# Altium project X-Sub_Board.PrjPcb
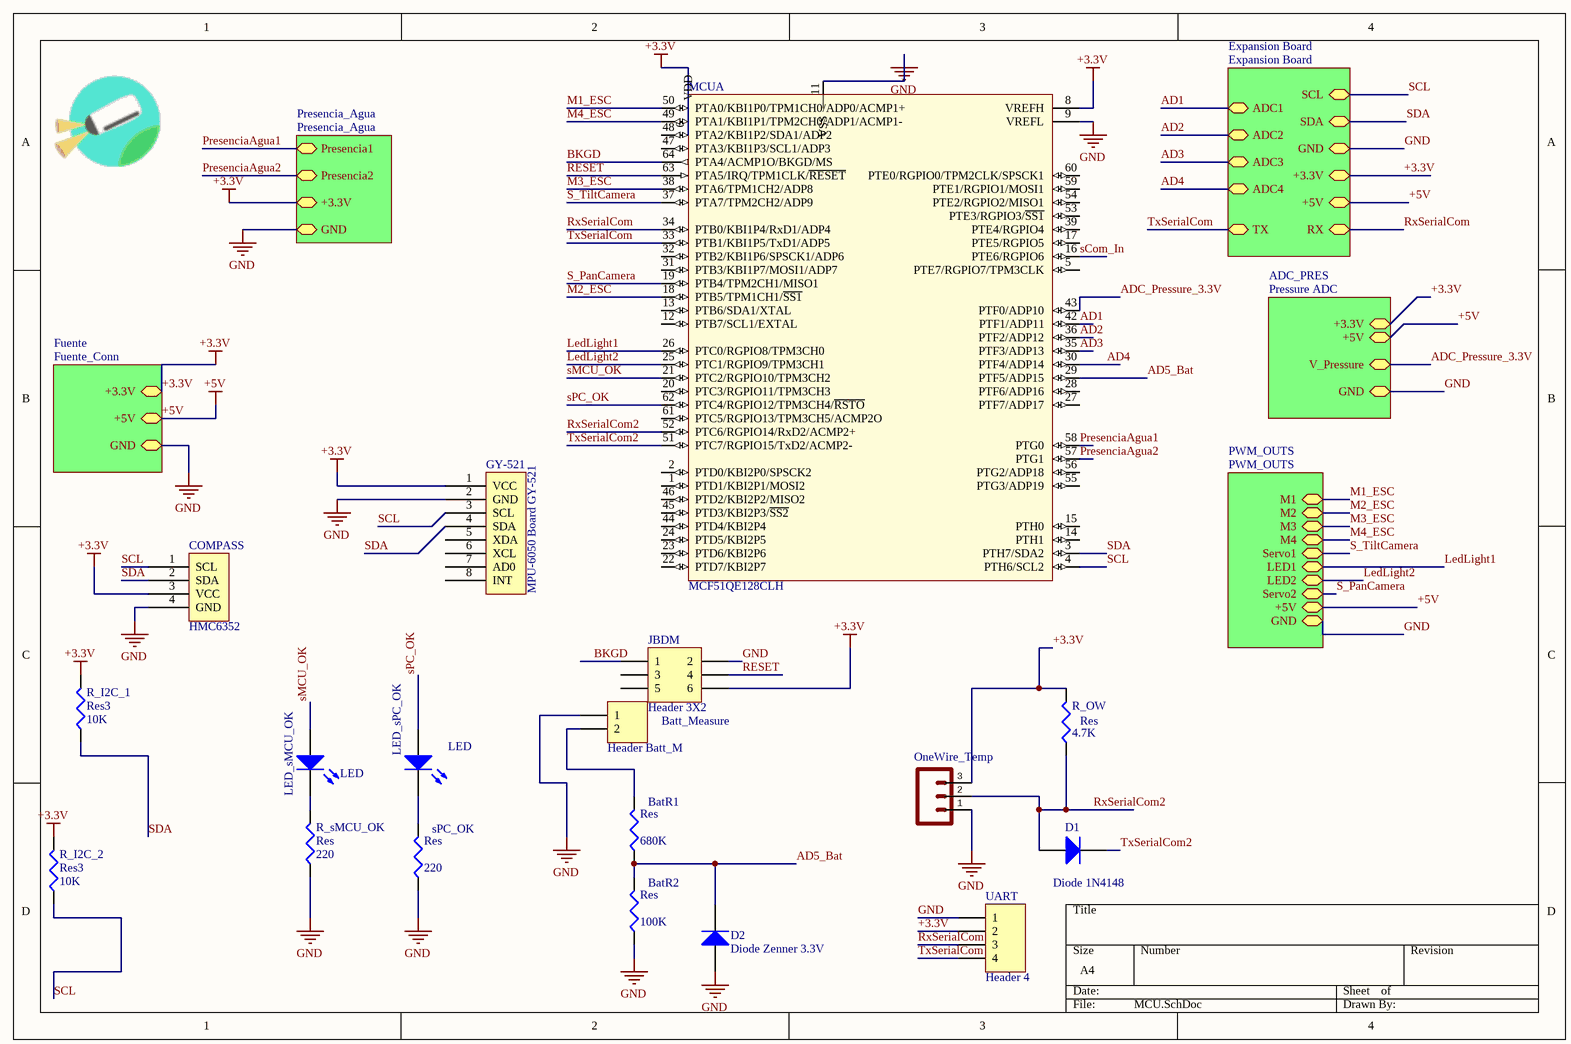
[diagram p0: MCU.SchDoc]
6 sheets, 40 parts. Net scope: hierarchical (ports join the sheet entries above them; power ports are global).
Board files: MCU.PcbDoc, LOGOS.PcbDoc
Sheets:
  MCU.SchDoc
    Fuente = Fuente_Conn.SchDoc
    Expansion Board = Expansion Board.SchDoc
    ADC_PRES = Pressure ADC.SchDoc
    PWM_OUTS = PWM_OUTS.SchDoc
    Presencia_Agua = Presencia_Agua.SchDoc

## Sheet MCU.SchDoc
size A4; PageSetup: Record=PageOptions|CenterHorizontal=True|CenterVertical=True|PrintScale=0.98|XCorrection=1.00|YCorrection=1.00|PrintKind=1|BorderSize=5000000|LeftOffset=0|BottomOffset=0|Orientation=2|PaperLength=1000|PaperWidth=1000|Scale=100|PaperSource=7|PrintQuality=-3|MediaType=1|DitherType=10|PrintScaleMode=1|PaperKind=Carta|PaperIndex=1

### Parts
BatR1  Res  value 680K  [6-0805_L]
BatR2  Res  value 100K  [6-0805_L]
Batt_Measure  Header Batt_M  [5.08mm 200 mil Screw Terminal SF]
COMPASS  HMC6352  [HMC6352_SF]
D1  Diode 1N4148  [miniMELF]
D2  Diode Zenner 3.3V  [miniMELF]
GY-521  MPU-6050 Board GY-521  [GY-521]
JBDM  Header 3X2  [HDR2X3]
LED_sMCU_OK  LED  [6-0805_L]
LED_sPC_OK  LED  [6-0805_L]
MCU  MCF51QE128CLH  [840F-02_N]  (part A of 2)
OneWire_Temp  (no value)  [HDR1X3]
R_I2C_1  Res3  value 10K  [6-0805_L]
R_I2C_2  Res3  value 10K  [6-0805_L]
R_OW  Res  value 4.7K  [6-0805_L]
R_sMCU_OK  Res  value 220  [6-0805_L]
sPC_OK  Res  value 220  [6-0805_L]
UART  Header 4  [HDR1X4]

### Sub-sheets
ADC_PRES = Pressure ADC: +3.3V, GND, V_Pressure (bidir), +5V
Expansion Board = Expansion Board: SCL, SDA, GND, +3.3V, +5V, ADC4 (bidir), ADC1 (bidir), ADC2 (bidir), ADC3 (bidir), RX, TX
Fuente = Fuente_Conn: +3.3V, +5V, GND
Presencia_Agua = Presencia_Agua: GND, +3.3V, Presencia2, Presencia1
PWM_OUTS = PWM_OUTS: M1, M2, M3, M4, LED1, LED2, +5V, GND, Servo1, Servo2

### Nets
+3.3V: COMPASS.3(VCC) GY-521.1(VCC) JBDM.6 MCU.6(VDD) MCU.8(VREFH) OneWire_Temp.3 R_I2C_1.2 R_I2C_2.2 R_OW.2 UART.2 ; sheet Fuente/+3.3V, sheet Expansion Board/+3.3V, sheet ADC_PRES/+3.3V, sheet Presencia_Agua/+3.3V
+5V: sheet Fuente/+5V, sheet Expansion Board/+5V, sheet ADC_PRES/+5V, sheet PWM_OUTS/+5V
GND: BatR2.1 Batt_Measure.1 COMPASS.4(GND) D2.1(A) GY-521.2(GND) JBDM.2 MCU.9(VREFL) MCU.11(VSS) OneWire_Temp.1 R_sMCU_OK.1 sPC_OK.1 UART.1 ; sheet Fuente/GND, sheet Expansion Board/GND, sheet ADC_PRES/GND, sheet PWM_OUTS/GND, sheet Presencia_Agua/GND
AD1: MCU.42(PTF1/ADP11) ; sheet Expansion Board/ADC1
AD2: MCU.36(PTF2/ADP12) ; sheet Expansion Board/ADC2
AD3: MCU.35(PTF3/ADP13) ; sheet Expansion Board/ADC3
AD4: MCU.30(PTF4/ADP14) ; sheet Expansion Board/ADC4
AD5_Bat: BatR1.1 BatR2.2 D2.2(K) MCU.29(PTF5/ADP15)
ADC_Pressure_3.3V: MCU.43(PTF0/ADP10) ; sheet ADC_PRES/V_Pressure
BKGD: JBDM.1 MCU.64(PTA4/ACMP1O/BKGD/MS)
LedLight1: MCU.26(PTC0/RGPIO8/TPM3CH0) ; sheet PWM_OUTS/LED1
LedLight2: MCU.25(PTC1/RGPIO9/TPM3CH1) ; sheet PWM_OUTS/LED2
M1_ESC: MCU.50(PTA0/KBI1P0/TPM1CH0/ADP0/ACMP1+) ; sheet PWM_OUTS/M1
M2_ESC: MCU.18(PTB5/TPM1CH1/~{SS1}) ; sheet PWM_OUTS/M2
M3_ESC: MCU.38(PTA6/TPM1CH2/ADP8) ; sheet PWM_OUTS/M3
M4_ESC: MCU.49(PTA1/KBI1P1/TPM2CH0/ADP1/ACMP1-) ; sheet PWM_OUTS/M4
PresenciaAgua1: MCU.58(PTG0) ; sheet Presencia_Agua/Presencia1
PresenciaAgua2: MCU.57(PTG1) ; sheet Presencia_Agua/Presencia2
RESET: JBDM.4 MCU.63(PTA5/IRQ/TPM1CLK/~{RESET})
RxSerialCom: MCU.34(PTB0/KBI1P4/RxD1/ADP4) UART.3 ; sheet Expansion Board/RX
RxSerialCom2: D1.1(A) MCU.52(PTC6/RGPIO14/RxD2/ACMP2+) OneWire_Temp.2 R_OW.1
S_PanCamera: MCU.19(PTB4/TPM2CH1/MISO1) ; sheet PWM_OUTS/Servo2
S_TiltCamera: MCU.37(PTA7/TPM2CH2/ADP9) ; sheet PWM_OUTS/Servo1
SCL: COMPASS.1(SCL) GY-521.3(SCL) MCU.4(PTH6/SCL2) R_I2C_2.1 ; sheet Expansion Board/SCL
sCom_In: MCU.16(PTE6/RGPIO6)
SDA: COMPASS.2(SDA) GY-521.4(SDA) MCU.3(PTH7/SDA2) R_I2C_1.1 ; sheet Expansion Board/SDA
sMCU_OK: LED_sMCU_OK.1(A) MCU.21(PTC2/RGPIO10/TPM3CH2)
sPC_OK: LED_sPC_OK.1(A) MCU.62(PTC4/RGPIO12/TPM3CH4/~{RSTO})
TxSerialCom: MCU.33(PTB1/KBI1P5/TxD1/ADP5) UART.4 ; sheet Expansion Board/TX
TxSerialCom2: D1.2(K) MCU.51(PTC7/RGPIO15/TxD2/ACMP2-)
NetBatR1_2: BatR1.2 Batt_Measure.2
NetLED_sMCU_OK_2: LED_sMCU_OK.2(K) R_sMCU_OK.2
NetLED_sPC_OK_2: LED_sPC_OK.2(K) sPC_OK.2

Not connected (* = marked no-connect by the designer): GY-521 5(XDA) 6(XCL) 7(AD0) 8(INT); JBDM 3 5; MCU 1(PTD1/KBI2P1/MOSI2) 2(PTD0/KBI2P0/SPSCK2) 5(PTE7/RGPIO7/TPM3CLK) 12(PTB7/SCL1/EXTAL) 13(PTB6/SDA1/XTAL) 14(PTH1) 15(PTH0) 17(PTE5/RGPIO5) 20(PTC3/RGPIO11/TPM3CH3) 22(PTD7/KBI2P7) 23(PTD6/KBI2P6) 24(PTD5/KBI2P5) 27(PTF7/ADP17) 28(PTF6/ADP16) 31(PTB3/KBI1P7/MOSI1/ADP7) 32(PTB2/KBI1P6/SPSCK1/ADP6) 39(PTE4/RGPIO4) 44(PTD4/KBI2P4) 45(PTD3/KBI2P3/~{SS2}) 46(PTD2/KBI2P2/MISO2) 47(PTA3/KBI1P3/SCL1/ADP3) 48(PTA2/KBI1P2/SDA1/ADP2) 53(PTE3/RGPIO3/~{SS1}) 54(PTE2/RGPIO2/MISO1) 55(PTG3/ADP19) 56(PTG2/ADP18) 59(PTE1/RGPIO1/MOSI1) 60(PTE0/RGPIO0/TPM2CLK/SPSCK1) 61(PTC5/RGPIO13/TPM3CH5/ACMP2O)

### Library data of the parts
BatR1 BatR2 R_I2C_1 R_I2C_2 R_OW R_sMCU_OK sPC_OK = Res3: Resistor; Published: 8-Jun-2000; LatestRevisionDate: 29-May-2009; LatestRevisionNote: IPC-7351 Footprint Added.; PackageReference: J1-0603; Publisher: Altium Limited; PackageDescription: Chip Resistor
Batt_Measure = Header 2: Header, 2-Pin; LatestRevisionDate: 17-Jul-2002; LatestRevisionNote: Re-released for DXP Platform.; Publisher: Altium Limited
D1 D2 = Diode 1N4148: High Conductance Fast Diode; Published: 8-Jun-2000; LatestRevisionDate: 17-Jul-2002; LatestRevisionNote: Re-released for DXP Platform.; DatasheetVersion: 1997; PackageReference: DO-35; Publisher: Altium Limited; PackageDescription: Diode, Axial; Body 3.8 x 1.9 mm (LxDia. max), Lead Dia. 0.53 mm (max); Code_JEDEC: DO-204-AH; ComponentLink1Description: Manufacturer Link; ComponentLink1URL: http://www.fairchildsemi.com/; ComponentLink2Description: Datasheet; ComponentLink2URL: http://www.fairchildsemi.com/ds/1N%2F1N4148.pdf
GY-521 = GY-521
JBDM = Header 3X2: Header, 3-Pin, Dual row; LatestRevisionDate: 17-Jul-2002; LatestRevisionNote: Re-released for DXP Platform.; Publisher: Altium Limited
LED_sMCU_OK LED_sPC_OK = LED2: Typical RED, GREEN, YELLOW, AMBER GaAs LED; Published: 8-Jun-2000; LatestRevisionDate: 17-Jul-2002; LatestRevisionNote: Re-released for DXP Platform.; PackageVersion: Feb-2002; PackageReference: 3.2X1.6X1.1; Publisher: Altium Limited; PackageDescription: SM LED; 2 Flat Leads
MCU = MCF51QE128CLH: MCF51QE128 ColdFire V1 Microcontroller, 32-Bit, 128KB Flash, 8KB RAM, -40°C to 85°C, 64-Pin LQFP; DatasheetVersion: rev7, Oct-2008; PackageVersion: rev6, Mar-2011; PackageReference: 840F-02; PackageDescription: 64-Pin Thin Quad Flat Pack, 10 x 10 mm Body, 0.5 mm Pitch; ComponentLink1Description: Manufacturer URL; ComponentLink1URL: http://www.freescale.com/; ComponentLink2Description: Datasheet; ComponentLink2URL: http://cache.freescale.com/files/32bit/doc/data_sheet/MCF51QE128.pdf?fpsp=1&WT_TYPE=Data%20Sheets&WT_VENDOR=FREESCALE&WT_FILE_FORMAT=pdf&WT_ASSET=Documentation
OneWire_Temp = M03-SCREW-5MM: STOREFRONT_ID: PRT-08433
UART = Header 4: Header, 4-Pin; LatestRevisionDate: 17-Jul-2002; LatestRevisionNote: Re-released for DXP Platform.; Publisher: Altium Limited

## Sheet Fuente_Conn.SchDoc
size Letter
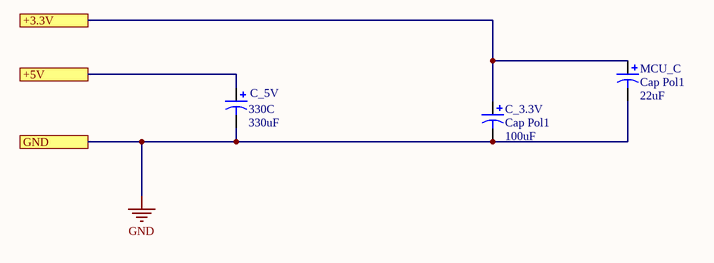
[diagram p1: Fuente_Conn.SchDoc]

### Parts
C_3.3V  Cap Pol1  value 100uF  [CAPR5-4X5]
C_5V  330C  value 330uF  [PANASONIC_C]
MCU_C  Cap Pol1  value 22uF  [CAPR5-4X5]

### Ports
+3.3V, +5V, GND

### Nets
+3.3V: C_3.3V.1 MCU_C.1 ; port +3.3V
+5V: C_5V.1 ; port +5V
GND: C_3.3V.2 C_5V.2 MCU_C.2 ; port GND

### Library data of the parts
C_3.3V C_5V MCU_C = Cap Pol1: Polarized Capacitor (Radial); Published: 8-Jun-2000; LatestRevisionDate: 17-Jul-2002; LatestRevisionNote: Re-released for DXP Platform.; PackageReference: RB7.6-15; Publisher: Altium Limited; PackageDescription: Polarized Capacitor (Radial); 2 Leads

## Sheet Expansion Board.SchDoc
size Letter
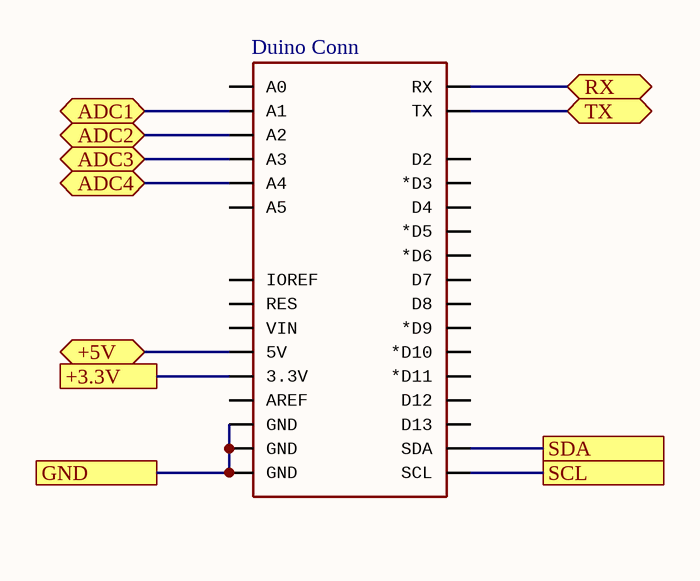
[diagram p2: Expansion Board.SchDoc]

### Parts
Duino_Conn  (no value)  [UNO_R3_SHIELD_NOLABELS]

### Ports
+3.3V, +5V, ADC1, ADC2, ADC3, ADC4, GND, RX, SCL, SDA, TX

### Nets
+3.3V: Duino_Conn.3.3V ; port +3.3V
+5V: Duino_Conn.5V ; port +5V
GND: Duino_Conn.GND@0(GND) Duino_Conn.GND@1(GND) Duino_Conn.GND@2(GND) ; port GND
AD1: Duino_Conn.A1 ; port ADC1
AD2: Duino_Conn.A2 ; port ADC2
AD3: Duino_Conn.A3 ; port ADC3
AD4: Duino_Conn.A4 ; port ADC4
RxSerialCom: Duino_Conn.RX ; port RX
SCL: Duino_Conn.SCL ; port SCL
SDA: Duino_Conn.SDA ; port SDA
TxSerialCom: Duino_Conn.TX ; port TX

Not connected (* = marked no-connect by the designer): Duino_Conn A0 A5 AREF D2 D3(*D3) D4 D5(*D5) D6(*D6) D7 D8 D9(*D9) D10(*D10) D11(*D11) D12 D13 IOREF RES VIN

### Library data of the parts
Duino_Conn = ARDUINO_R3_SHIELDNOLABELS

## Sheet Pressure ADC.SchDoc
size Letter
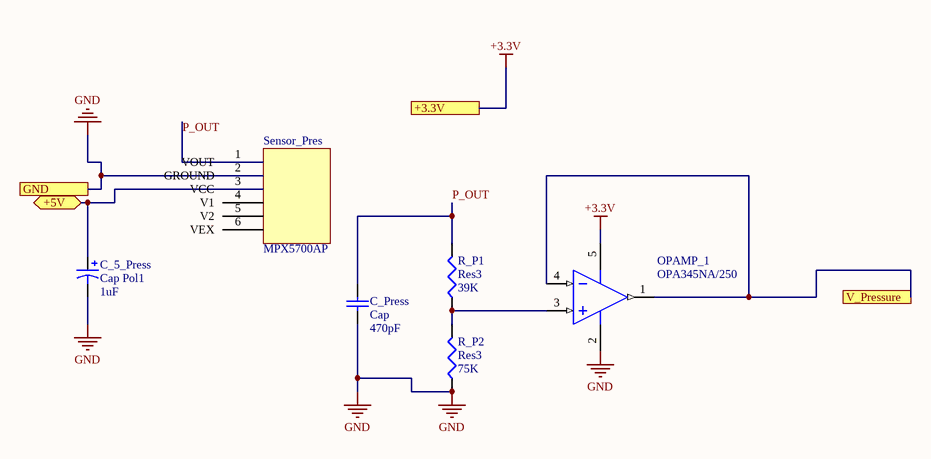
[diagram p3: Pressure ADC.SchDoc]

### Parts
C_5_Press  Cap Pol1  value 1uF  [CAPR5-4X5]
C_Press  Cap  value 470pF  [J1-0603]
OPAMP_1  OPA345NA/250  [TI-DBV5_N]
R_P1  Res3  value 39K  [J1-0603]
R_P2  Res3  value 75K  [J1-0603]
Sensor_Pres  MPX5700AP  [HDR1X6H]

### Ports
+3.3V, +5V, GND, V_Pressure

### Nets
+3.3V: OPAMP_1.5(V+) ; port +3.3V
+5V: C_5_Press.1 Sensor_Pres.3(VCC) ; port +5V
GND: C_5_Press.2 C_Press.1 OPAMP_1.2(V-) R_P2.1 Sensor_Pres.2(GROUND) ; port GND
ADC_Pressure_3.3V: OPAMP_1.1(OUT) OPAMP_1.4(IN-) ; port V_Pressure
P_OUT: C_Press.2 R_P1.2 Sensor_Pres.1(VOUT)
NetOPAMP_1_3: OPAMP_1.3(IN+) R_P1.1 R_P2.2

Not connected (* = marked no-connect by the designer): Sensor_Pres 4(V1) 5(V2) 6(VEX)

### Library data of the parts
C_5_Press = Cap Pol1: Polarized Capacitor (Radial); Published: 8-Jun-2000; LatestRevisionDate: 17-Jul-2002; LatestRevisionNote: Re-released for DXP Platform.; PackageReference: RB7.6-15; Publisher: Altium Limited; PackageDescription: Polarized Capacitor (Radial); 2 Leads
C_Press = Cap: Capacitor; Published: 8-Jun-2000; LatestRevisionDate: 17-Jul-2002; LatestRevisionNote: Re-released for DXP Platform.; PackageReference: RAD-0.3; Publisher: Altium Limited; PackageDescription: Radial Cap, Thru-Hole; 2 Leads; 0.3 in Pin Spacing
OPAMP_1 = OPA345NA/250: Low Power, Single-Supply, Rail-to-Rail Operational Amplifier MicroAmplifier(TM) Series, 2.7 to 5.5 V, -55 to 125 degC, 5-pin SOT23 (DBV5), Green (RoHS & no Sb/Br); Manufacturer: Texas Instruments; CMRR(Min)(dB): 76; IIB(Max)(pA): 10; Iq per channel(Max)(mA): 0.25; Number of Channels: 1; Offset Drift(Typ)(uV/C): 3; Slew Rate(Typ)(V/us): 2; Sub Family: Low Input Bias Current Amp (<=10pA), Low Power Amp (<=500uA), Low Supply Voltage Amplifier (<=2.7V), Precision Amplifier; Total Supply Voltage(Max)(+5V is 5, +/-5V is 10): 5.5; Total Supply Voltage(Min)(+5V is 5, +/-5V is 10): 2.7; DatasheetVersion: SBOS107A; PackageVersion: 4073253-4/K, 03/2006; PackageReference: DBV5; PackageDescription: 5-Pin Plastic Small Outline, Body 1.6 x 2.9 mm, Pitch 0.95 mm; Supplier 1: Digi-Key; Supplier Part Number 1: OPA345NATR-ND; Supplier 2: Digi-Key; Supplier Part Number 2: OPA345NACT-ND; Supplier 3: Digi-Key; Supplier Part Number 3: OPA345NADKR-ND; Supplier 4: Farnell; Supplier Part Number 4: 1648703; Supplier 5: Newark; Supplier Part Number 5: 75C4876; Supplier 6: Mouser; Supplier Part Number 6: 595-OPA345NA/250; Eco-Plan: Green (RoHS & no Sb/Br); Vio (25C)(Max)(mV): 1; Mounting Technology: Surface Mount; Code_JEDEC: MO-178; PartNumber: OPA345NA/250; ComponentLink1Description: Manufacturer URL; ComponentLink1URL: http://www.ti.com/; ComponentLink2Description: Datasheet; ComponentLink2URL: http://www.ti.com/general/docs/lit/getliterature.tsp?genericPartNumber=OPA345&fileType=pdf; ComponentLink3Description: Package Specification; ComponentLink3URL: http://www.ti.com/litv/pdf/mpds018i
R_P1 R_P2 = Res3: Resistor; Published: 8-Jun-2000; LatestRevisionDate: 29-May-2009; LatestRevisionNote: IPC-7351 Footprint Added.; PackageReference: J1-0603; Publisher: Altium Limited; PackageDescription: Chip Resistor

## Sheet PWM_OUTS.SchDoc
size Letter
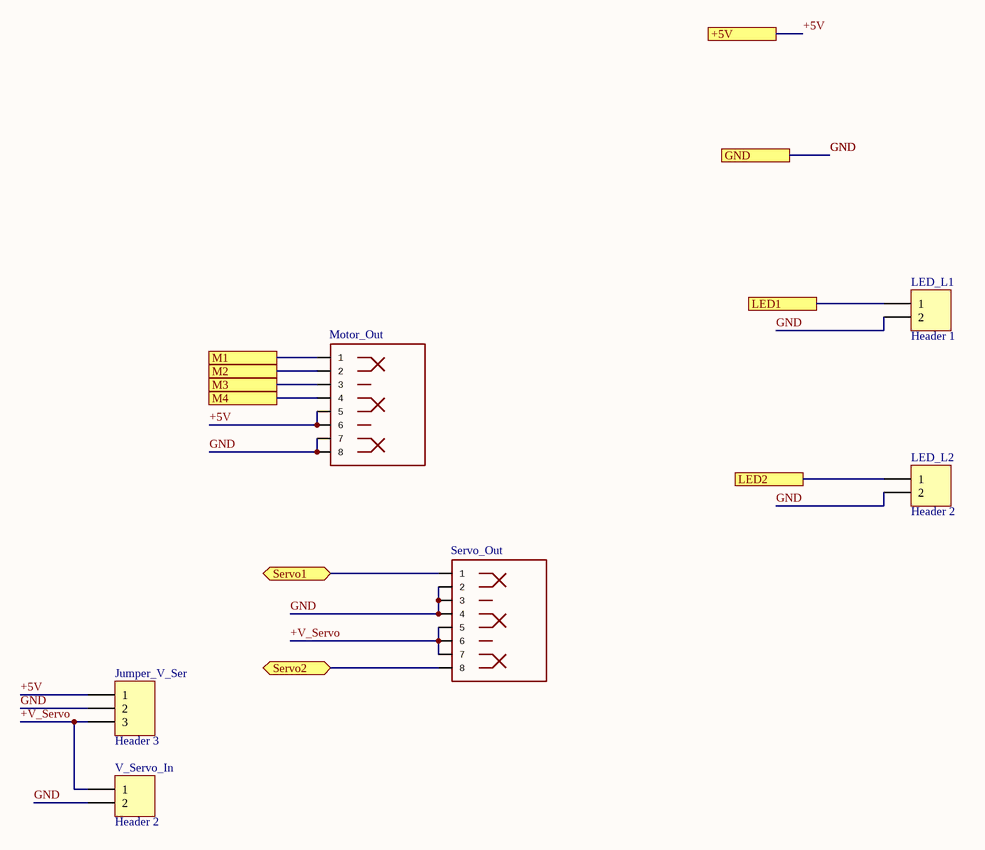
[diagram p4: PWM_OUTS.SchDoc]

### Parts
Jumper_V_Ser  Header 3  [HDR1X3]
LED_L1  Header 1  [HDR1X2]
LED_L2  Header 2  [HDR1X2]
Motor_Out  (no value)  [RJ45-8]
Servo_Out  (no value)  [RJ45-8]
V_Servo_In  Header 2  [HDR1X2]

### Ports
+5V, GND, LED1, LED2, M1, M2, M3, M4, Servo1, Servo2

### Nets
+5V: Jumper_V_Ser.1 Motor_Out.5 Motor_Out.6 ; port +5V
GND: Jumper_V_Ser.2 LED_L1.2 LED_L2.2 Motor_Out.7 Motor_Out.8 Servo_Out.2 Servo_Out.3 Servo_Out.4 V_Servo_In.2 ; port GND
+V_Servo: Jumper_V_Ser.3 Servo_Out.5 Servo_Out.6 Servo_Out.7 V_Servo_In.1
LedLight1: LED_L1.1 ; port LED1
LedLight2: LED_L2.1 ; port LED2
M1_ESC: Motor_Out.1 ; port M1
M2_ESC: Motor_Out.2 ; port M2
M3_ESC: Motor_Out.3 ; port M3
M4_ESC: Motor_Out.4 ; port M4
S_PanCamera: Servo_Out.8 ; port Servo2
S_TiltCamera: Servo_Out.1 ; port Servo1

### Library data of the parts
Jumper_V_Ser = Header 3: Header, 3-Pin; LatestRevisionDate: 17-Jul-2002; LatestRevisionNote: Re-released for DXP Platform.; Publisher: Altium Limited
LED_L1 LED_L2 V_Servo_In = Header 2: Header, 2-Pin; LatestRevisionDate: 17-Jul-2002; LatestRevisionNote: Re-released for DXP Platform.; Publisher: Altium Limited
Motor_Out Servo_Out = RJ45-8PTH: PROD_ID: CONN-08506

## Sheet Presencia_Agua.SchDoc
size Letter
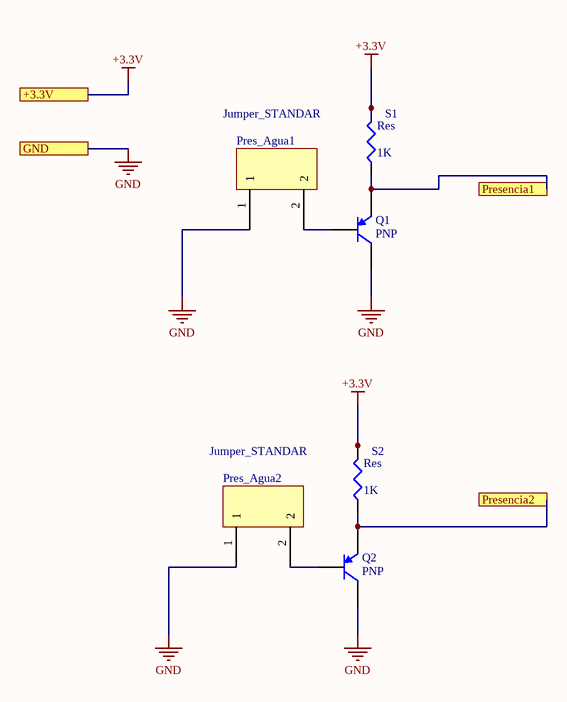
[diagram p5: Presencia_Agua.SchDoc]

### Parts
Pres_Agua1  Jumper_STANDAR  [HDR1X2H]
Pres_Agua2  Jumper_STANDAR  [HDR1X2H]
Q1  PNP  [SOT-23B_L]
Q2  PNP  [SOT-23B_L]
S1  Res  value 1K  [RESC6332]
S2  Res  value 1K  [RESC6332]

### Ports
+3.3V, GND, Presencia1, Presencia2

### Nets
+3.3V: S1.2 S2.2 ; port +3.3V
GND: Pres_Agua1.1 Pres_Agua2.1 Q1.1(C) Q2.1(C) ; port GND
PresenciaAgua1: Q1.3(E) S1.1 ; port Presencia1
PresenciaAgua2: Q2.3(E) S2.1 ; port Presencia2
NetPres_Agua1_2: Pres_Agua1.2 Q1.2(B)
NetPres_Agua2_2: Pres_Agua2.2 Q2.2(B)

### Library data of the parts
Q1 Q2 = PNP: PNP Bipolar Transistor; Published: 8-Jun-2000; LatestRevisionDate: 29-May-2009; LatestRevisionNote: IPC-7351 Footprint Added.; PackageVersion: Aug-1999; PackageReference: SOT-23B; Publisher: Altium Limited; PackageDescription: 3-Pin SOT-23 Package 0.95 mm Pitch, 2.4 mm Lead Span
S1 S2 = Res3: Resistor; Published: 8-Jun-2000; LatestRevisionDate: 29-May-2009; LatestRevisionNote: IPC-7351 Footprint Added.; PackageReference: J1-0603; Publisher: Altium Limited; PackageDescription: Chip Resistor

## Nets that join several sheets
+3.3V: MCU (10 pins), Fuente_Conn (C_3.3V.1 MCU_C.1), Expansion Board (Duino_Conn.3.3V), Pressure ADC (OPAMP_1.5), Presencia_Agua (S1.2 S2.2)
+5V: Fuente_Conn (C_5V.1), Expansion Board (Duino_Conn.5V), Pressure ADC (C_5_Press.1 Sensor_Pres.3), PWM_OUTS (Jumper_V_Ser.1 Motor_Out.5 Motor_Out.6)
GND: MCU (12 pins), Fuente_Conn (C_3.3V.2 C_5V.2 MCU_C.2), Expansion Board (Duino_Conn.GND@0 Duino_Conn.GND@1 Duino_Conn.GND@2), Pressure ADC (5 pins), PWM_OUTS (9 pins), Presencia_Agua (Pres_Agua1.1 Pres_Agua2.1 Q1.1 Q2.1)
AD1: MCU (MCU.42), Expansion Board (Duino_Conn.A1)
AD2: MCU (MCU.36), Expansion Board (Duino_Conn.A2)
AD3: MCU (MCU.35), Expansion Board (Duino_Conn.A3)
AD4: MCU (MCU.30), Expansion Board (Duino_Conn.A4)
ADC_Pressure_3.3V: MCU (MCU.43), Pressure ADC (OPAMP_1.1 OPAMP_1.4)
LedLight1: MCU (MCU.26), PWM_OUTS (LED_L1.1)
LedLight2: MCU (MCU.25), PWM_OUTS (LED_L2.1)
M1_ESC: MCU (MCU.50), PWM_OUTS (Motor_Out.1)
M2_ESC: MCU (MCU.18), PWM_OUTS (Motor_Out.2)
M3_ESC: MCU (MCU.38), PWM_OUTS (Motor_Out.3)
M4_ESC: MCU (MCU.49), PWM_OUTS (Motor_Out.4)
PresenciaAgua1: MCU (MCU.58), Presencia_Agua (Q1.3 S1.1)
PresenciaAgua2: MCU (MCU.57), Presencia_Agua (Q2.3 S2.1)
RxSerialCom: MCU (MCU.34 UART.3), Expansion Board (Duino_Conn.RX)
S_PanCamera: MCU (MCU.19), PWM_OUTS (Servo_Out.8)
S_TiltCamera: MCU (MCU.37), PWM_OUTS (Servo_Out.1)
SCL: MCU (COMPASS.1 GY-521.3 MCU.4 R_I2C_2.1), Expansion Board (Duino_Conn.SCL)
SDA: MCU (COMPASS.2 GY-521.4 MCU.3 R_I2C_1.1), Expansion Board (Duino_Conn.SDA)
TxSerialCom: MCU (MCU.33 UART.4), Expansion Board (Duino_Conn.TX)